# EAGLE design mod_temperature (EAGLE 7.3.0)
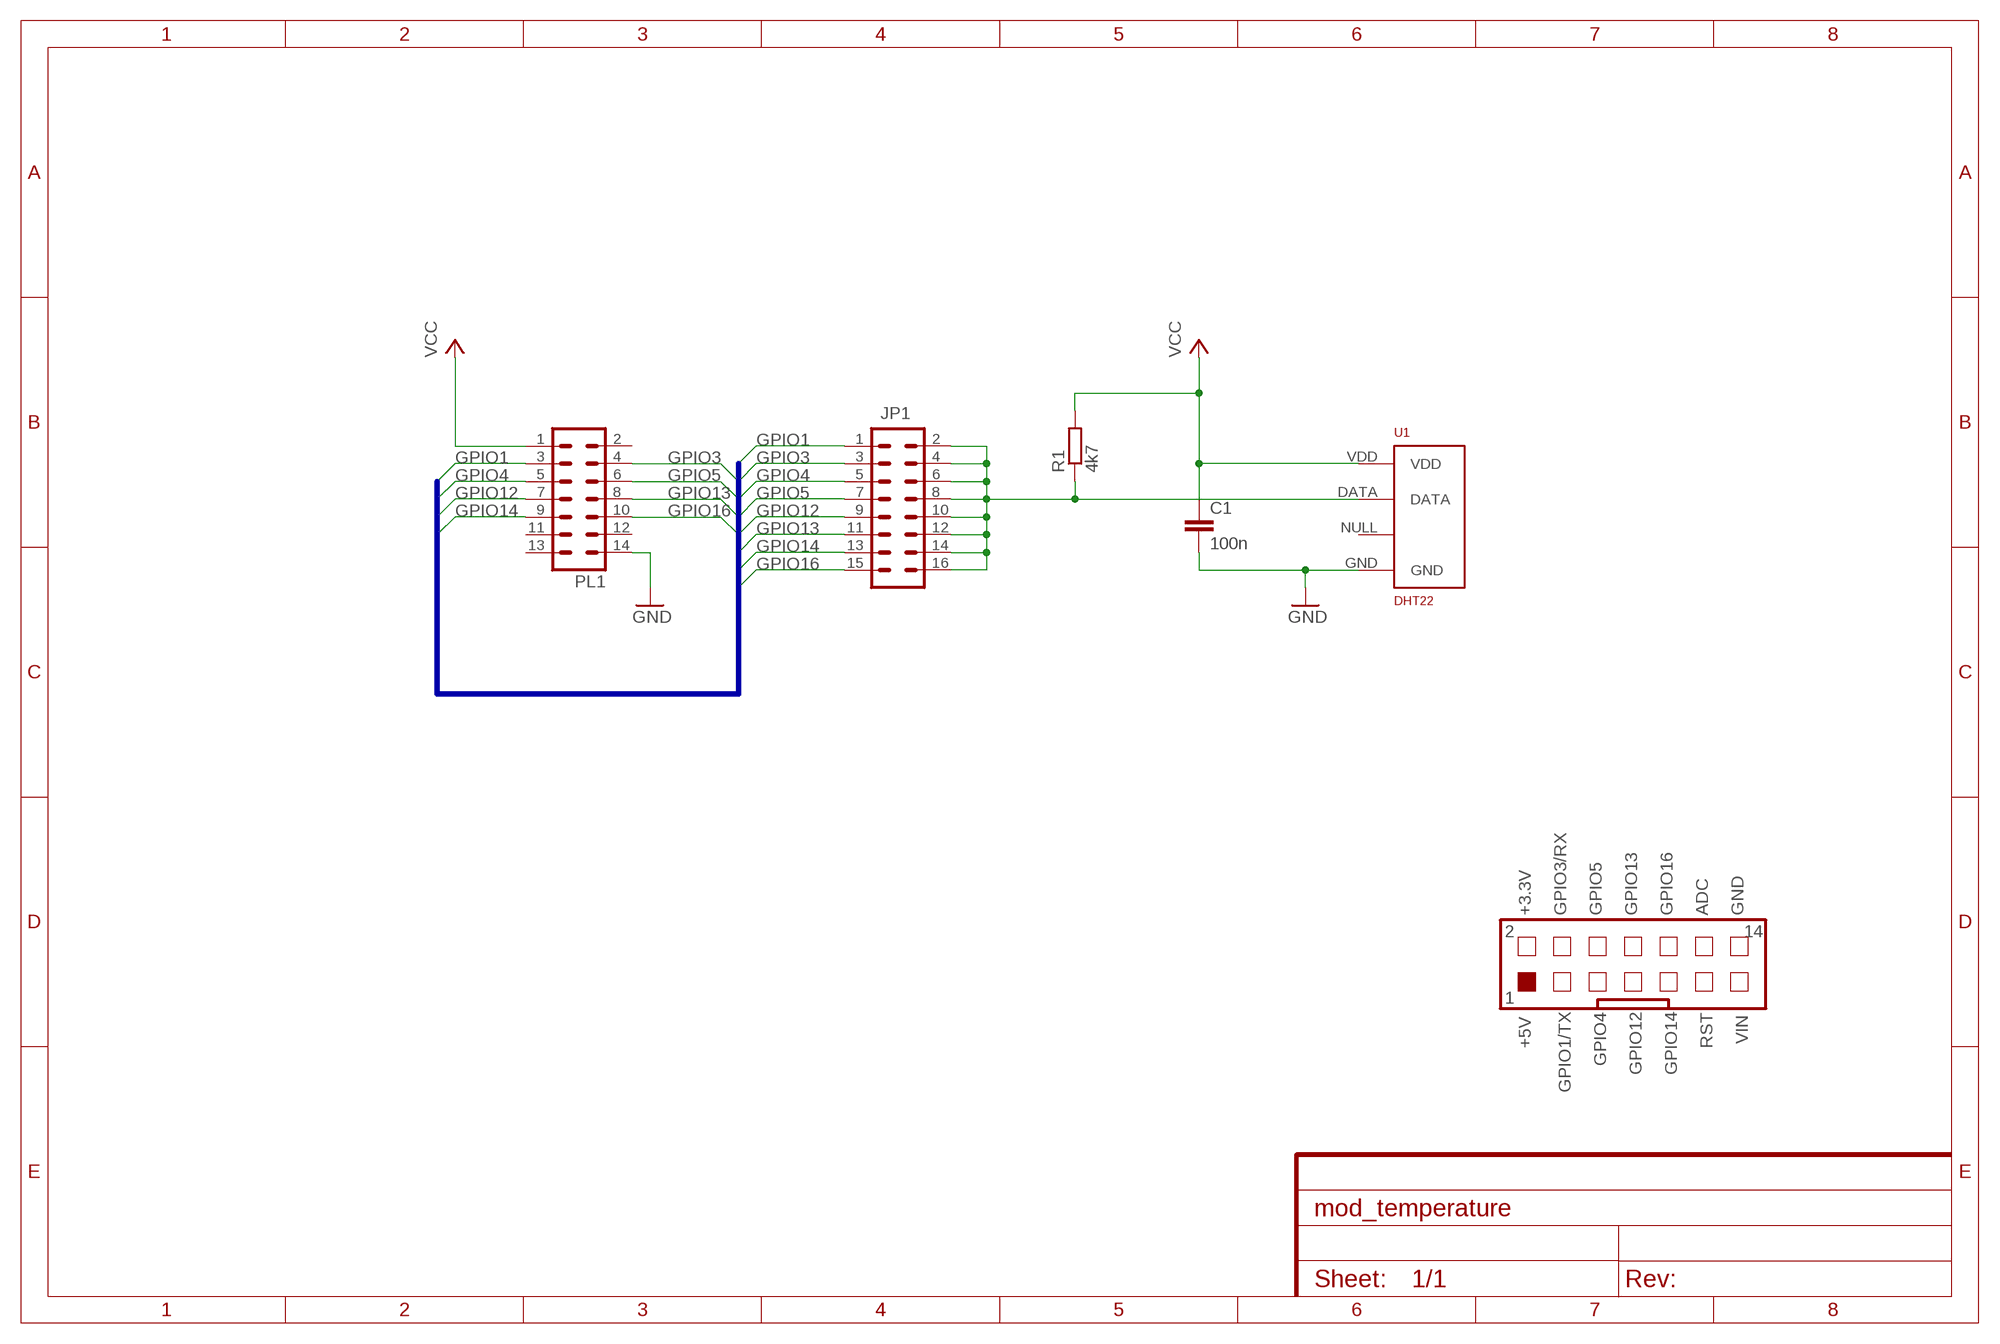
[diagram p0: schematic, sheet 1]
FRAME1 (FRAME-A4L): CNAME: Temperature sensor for IoT Module; CREVISION: 1; DESIGNER: M.Vagovszky

## Parts
C1  100n  C-EU025-025X050  [C025-025X050]
JP1  M08X2  [2X8]
PL1  14V  [14V]
R1  4k7  R-EU_0207/10  [0207/10]
U1  DHT22  RHT03_DHT-22_AM2302RA  [RHT03_DHT-22/RA]

## Nets
GND: C1.2 PL1.14 U1.GND
GPIO1: JP1.1 PL1.3
GPIO3: JP1.3 PL1.4
GPIO4: JP1.5 PL1.5
GPIO5: JP1.7 PL1.6
GPIO12: JP1.9 PL1.7
GPIO13: JP1.11 PL1.8
GPIO14: JP1.13 PL1.9
GPIO16: JP1.15 PL1.10
N$2: JP1.2 JP1.4 JP1.6 JP1.8 JP1.10 JP1.12 JP1.14 JP1.16 R1.1 U1.DATA
VCC: C1.1 PL1.1 R1.2 U1.VDD
Unconnected: PL1.2 PL1.11 PL1.12 PL1.13 U1.NULL

## Buses
BUS:GPIO16,GPIO[4..5],GPIO[12..14],GPIO1,GPIO3

## Notes on the sheet
- +3.3V | GPIO3/RX | GPIO5 | GPIO13 | GPIO16 | ADC | GND
- 2 | 14
- 1
- +5V | RST | VIN
- GPIO4
- GPIO12 | GPIO14
- GPIO1/TX

## Library data of the parts
C1 = rcl:C-EU: CAPACITOR, European symbol
JP1 = SparkFun-Connectors:M08X2: .1" headers, two rows of 8 each
PL1 = con-harting-v:14V: CONNECTOR; OC_FARNELL: unknown; OC_NEWARK: unknown
R1 = rcl:R-EU_: RESISTOR, European symbol
U1 = RHT03_DHT-22_AM2302:RHT03_DHT-22_AM2302: RHT03 / DHT-22 / AM2302 Packages and symbol for the RHT03 / DHT-22 relative humidity and temperature sensor. Note: The AM2302 is a wired version of the DHT-22 which typically requires less clearance and is thus provided as a separate package.; PROD_ID: SEN-10167

## Board
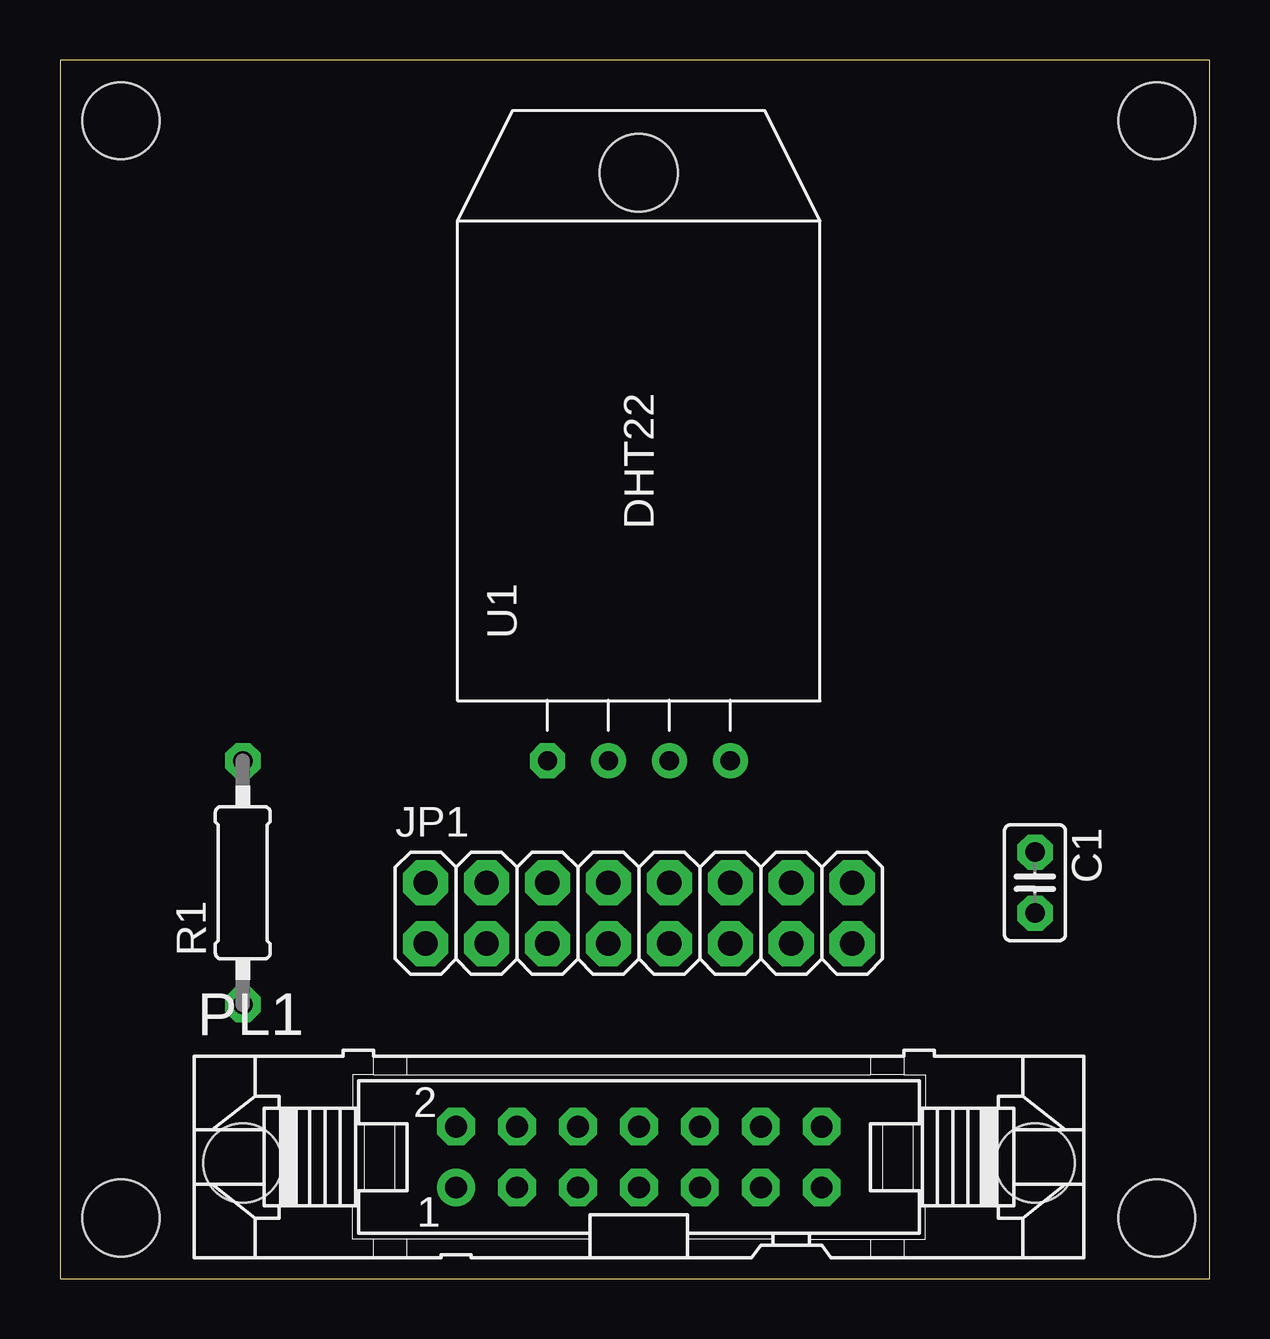
[diagram p1: board, top side]
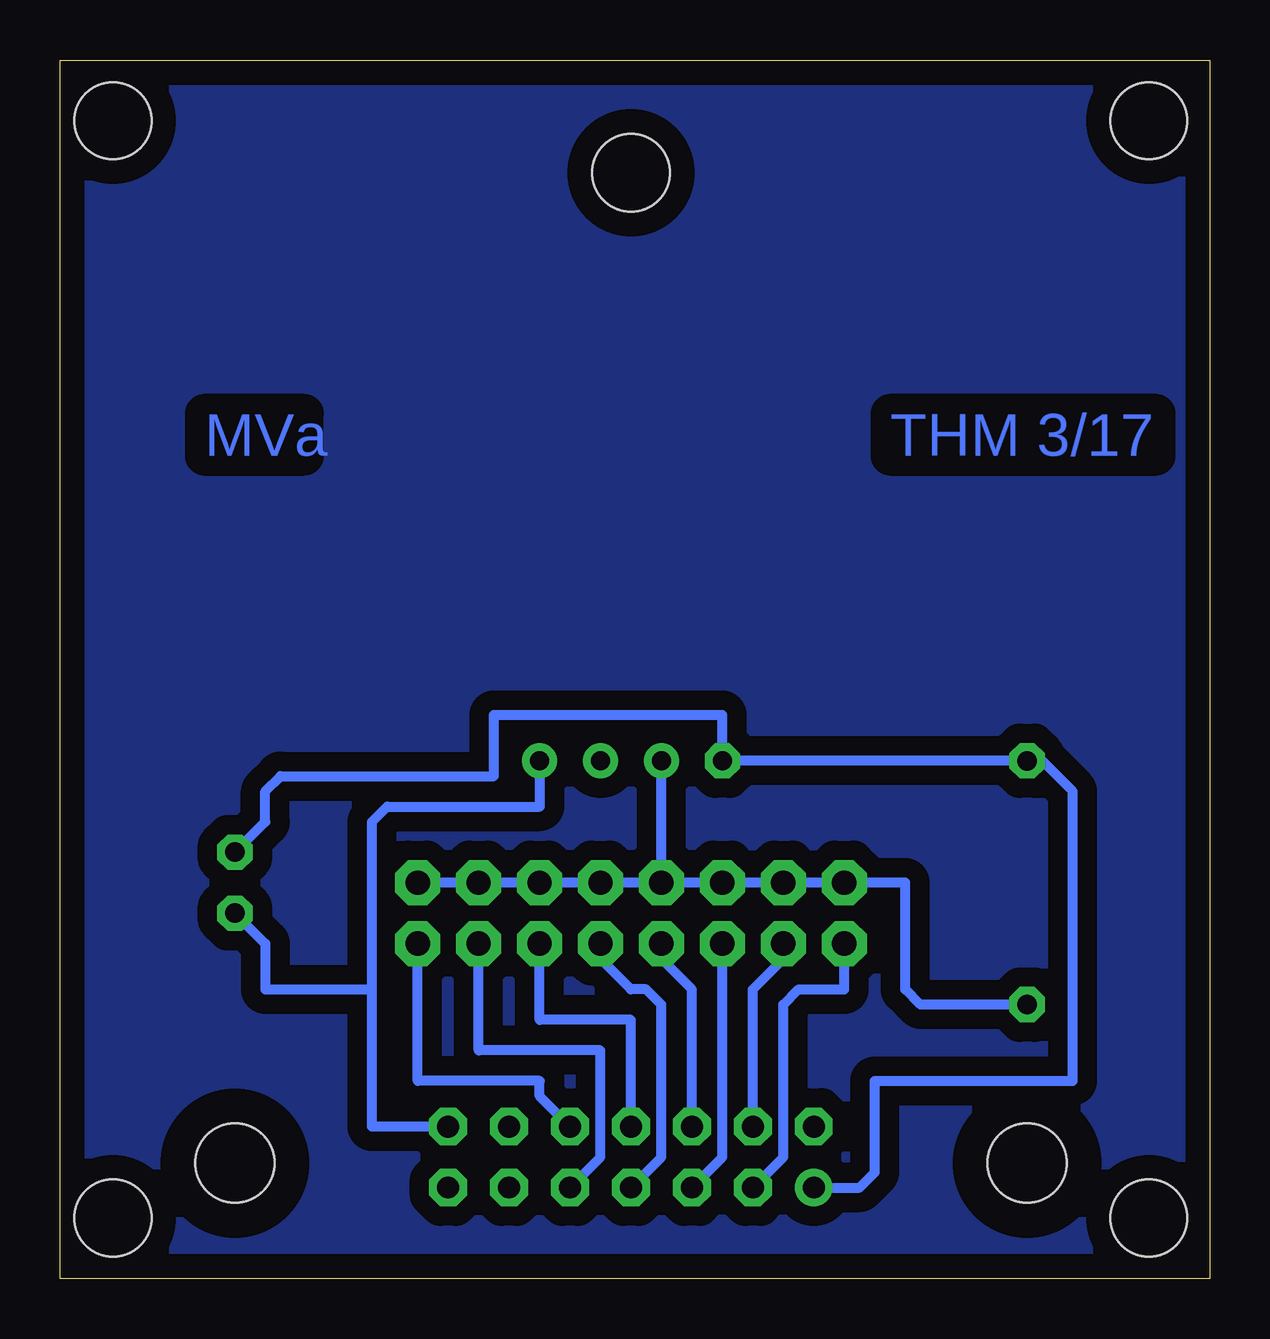
[diagram p2: board, bottom side, seen from below]

Size 47.93 x 50.79 mm. Coordinates in mm from the lower left corner, seen from the top.
Outline: 0,0 47.93,0 47.93,50.79 0,50.79 0,0
Copper layers (1*16): Top 0.035mm / dielectric 1.5mm / Bottom 0.035mm
Design rules "default *": minimum track width 10mil, minimum drill 24mil, track to track 8mil, track to pad 8mil, pad to pad 8mil, via to via 8mil, smd to smd 8mil, copper to edge 40mil, drill to drill 8mil, minimum pad ring 13mil, minimum via ring 8mil, stop-mask expansion 4mil, vias tented up to drill 0mil, thermal gap 10mil
Holes 3.2 mm at 2.54,2.54 45.72,2.54 45.72,2.54 2.54,48.26 45.72,48.26

### Footprints (pad centres in the part's own frame; a part is rotated, then mirrored left to right if it is on the bottom)
C025-025X050 = drill 0.813 octagon: 1 -1.27,0; 2 1.27,0
2X8 = drill 1.016 pad 1.88 octagon: 1 0,0; 2 0,2.54; 3 2.54,0; 4 2.54,2.54; 5 5.08,0; 6 5.08,2.54; 7 7.62,0; 8 7.62,2.54; 9 10.16,0; 10 10.16,2.54; 11 12.7,0; 12 12.7,2.54; 13 15.24,0; 14 15.24,2.54; 15 17.78,0; 16 17.78,2.54
14V = drill 0.914: 1 -7.62,-1.27 | drill 0.914 octagon: 2 -7.62,1.27; 3 -5.08,-1.27; 4 -5.08,1.27; 5 -2.54,-1.27; 6 -2.54,1.27; 7 0,-1.27; 8 0,1.27; 9 2.54,-1.27; 10 2.54,1.27; 11 5.08,-1.27; 12 5.08,1.27; 13 7.62,-1.27; 14 7.62,1.27 | hole 3.302: 16.51,-0.254; -16.51,-0.254
0207/10 = drill 0.813 octagon: 1 -5.08,0; 2 5.08,0
RHT03_DHT-22/RA = drill 0.8: DATA -1.27,0; GND 3.81,0; NULL 1.27,0 | drill 0.8 octagon: VDD -3.81,0 | hole 3.25: 0,24.5

### Placement (x,y rotation side)
C1  40.64,16.51 270 top
JP1  15.24,13.97 0 top
PL1  24.13,5.08 0 top
R1  7.62,16.51 90 top
U1  24.13,21.59 0 top

### Tracks (layer width: path | path; a pad name or v marks a point on that pad's centre or on a via)
GND
  Bottom 0.406: PL1.14 34.92,6.35 34.92,12.06 | C1.2 39.37,13.97 39.37,12.06 34.92,12.06 | U1.GND 27.94,19.68 34.29,19.68 34.92,19.05 34.92,12.06
GPIO1
  Bottom 0.406: PL1.3 17.78,5.08 17.78,11.43 17.14,12.06 15.24,12.06 JP1.1
GPIO3
  Bottom 0.406: PL1.4 19.05,12.06 17.78,13.34 JP1.3
GPIO4
  Bottom 0.406: PL1.5 20.32,5.08 JP1.5
GPIO5
  Bottom 0.406: PL1.6 21.59,12.06 22.86,13.34 JP1.7
GPIO12
  Bottom 0.406: PL1.7 22.86,5.08 22.86,11.43 23.5,12.06 24.13,12.06 25.4,13.34 JP1.9
GPIO13
  Bottom 0.406: PL1.8 24.13,10.79 27.94,10.79 JP1.11
GPIO14
  Bottom 0.406: PL1.9 25.4,5.08 25.4,9.53 30.48,9.53 JP1.13
GPIO16
  Bottom 0.406: PL1.10 27.94,7.62 27.94,8.26 33.02,8.26 JP1.15
N$1
  pour Bottom (isolate 0.813): 0,50.8 0,0 47.62,0 47.62,50.8
N$2
  Bottom 0.406: JP1.8 JP1.6 JP1.4 JP1.2 12.7,16.51 12.7,12.06 12.06,11.43 R1.1 | JP1.8 JP1.10 JP1.12 JP1.14 JP1.16 | JP1.8 U1.DATA
VCC
  Bottom 0.406: PL1.1 14.61,3.81 13.97,4.45 13.97,8.26 5.71,8.26 5.71,20.32 6.99,21.59 R1.2 U1.VDD 20.32,23.5 29.84,23.5 29.84,20.95 38.73,20.95 39.37,20.32 39.37,19.05 C1.1

### Text on the board
Bottom: THM 3/17 | MVa